# Altium project HoverBall_main.PrjPcb
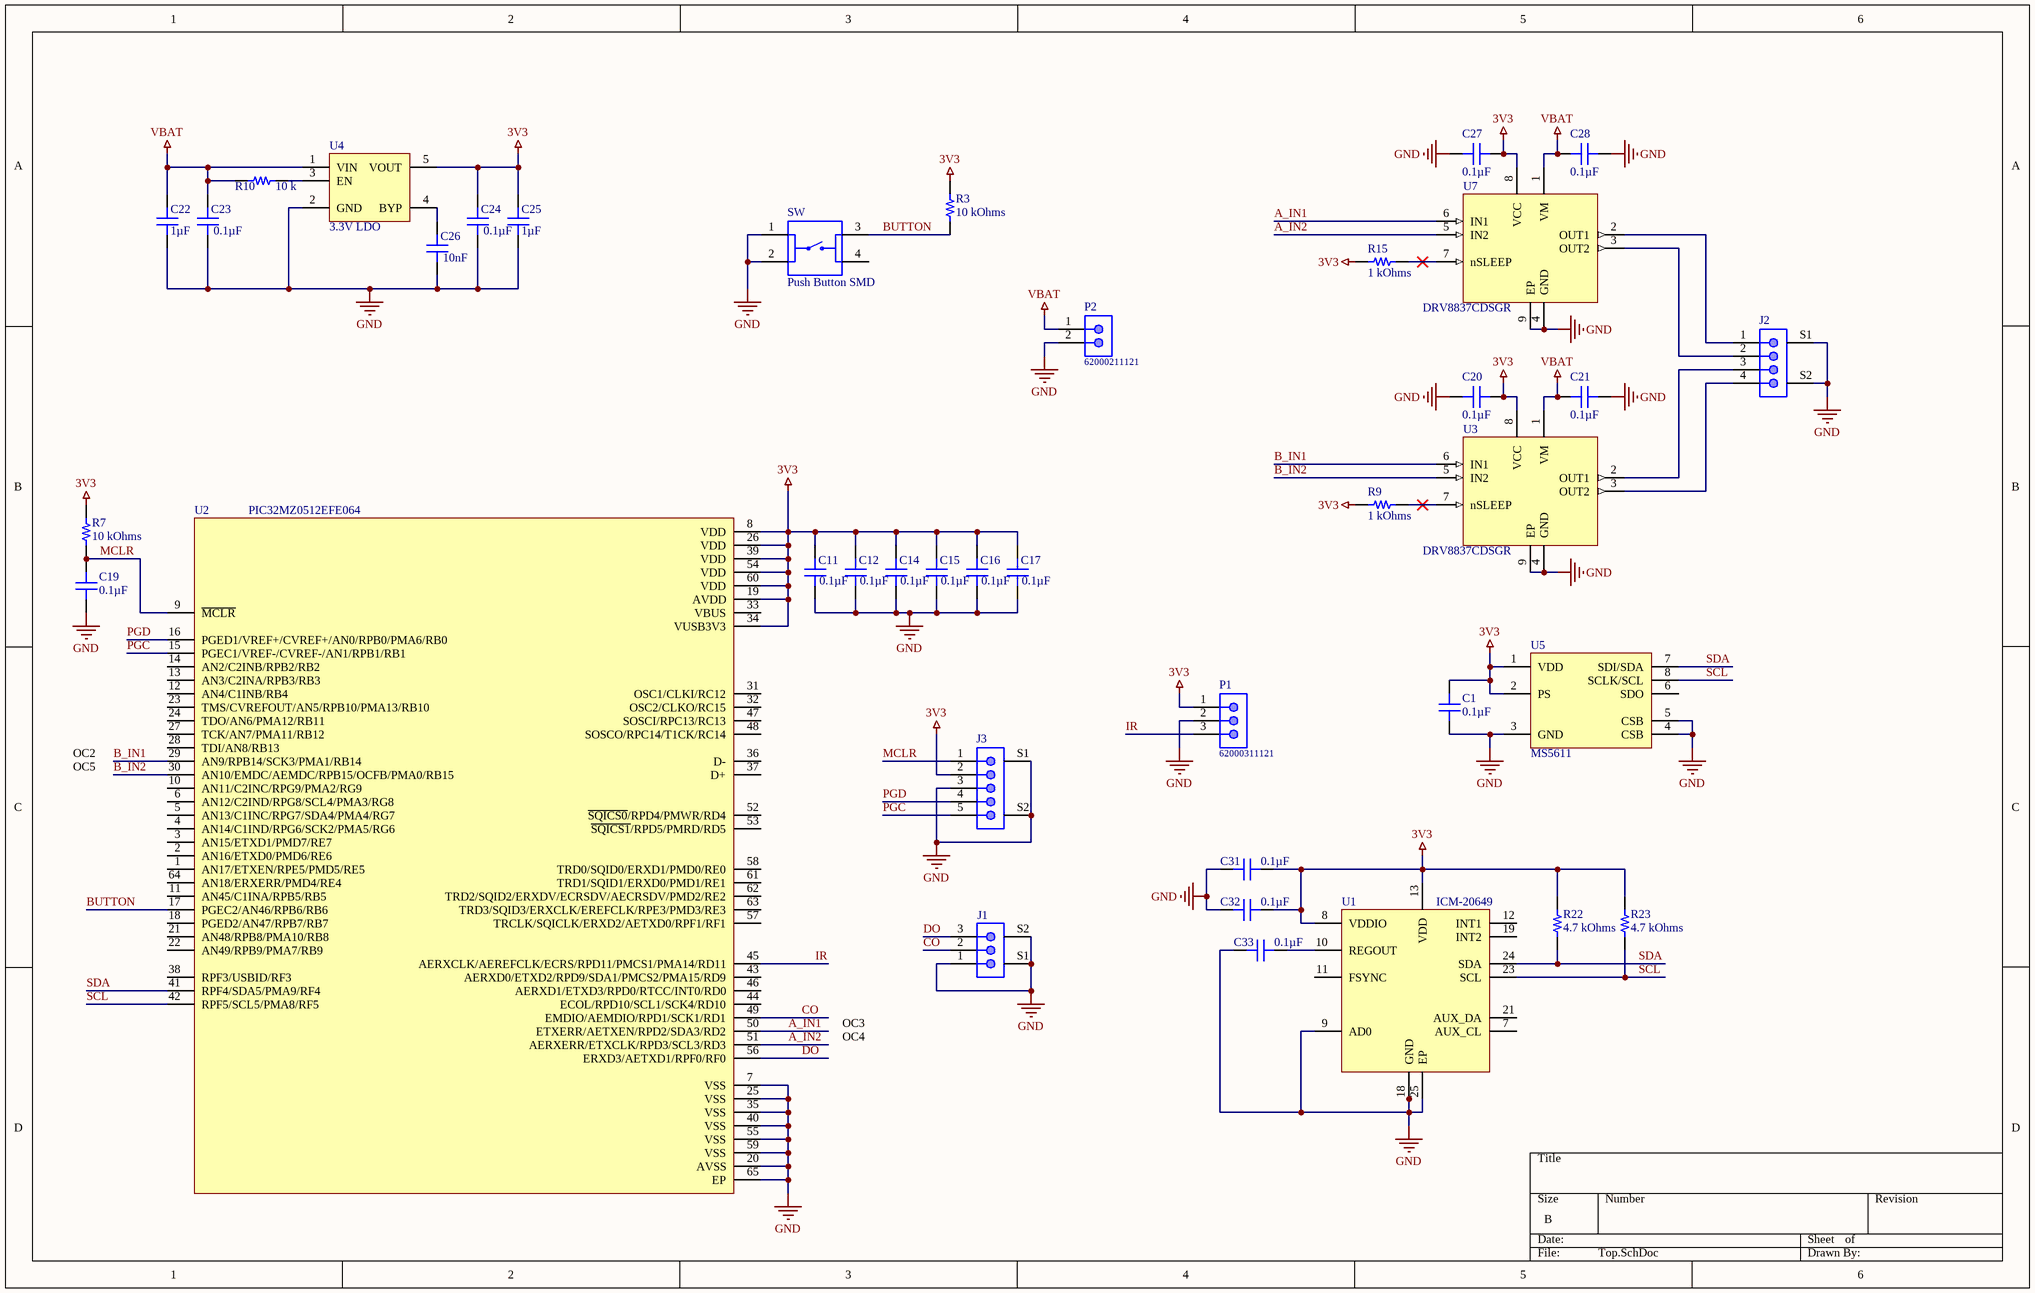
[diagram p0: Top.SchDoc]
1 sheet, 39 parts. Net scope: global (net labels, ports and power ports of the same name join across sheets).
Board file: HoverBall.PcbDoc

## Sheet Top.SchDoc
size B

### Parts
C1  0.1µF  [CAP 0603_1608]
C11  0.1µF  [CAP 0603_1608]
C12  0.1µF  [CAP 0603_1608]
C14  0.1µF  [CAP 0603_1608]
C15  0.1µF  [CAP 0603_1608]
C16  0.1µF  [CAP 0603_1608]
C17  0.1µF  [CAP 0603_1608]
C19  0.1µF  [CAP 0603_1608]
C20  0.1µF  [CAP 0603_1608]
C21  0.1µF  [CAP 0603_1608]
C22  1µF  [CAP 0603_1608]
C23  0.1µF  [CAP 0603_1608]
C24  0.1µF  [CAP 0603_1608]
C25  1µF  [CAP 0603_1608]
C26  10nF  [CAP 0603_1608]
C27  0.1µF  [CAP 0603_1608]
C28  0.1µF  [CAP 0603_1608]
C31  0.1µF  [CAP 0603_1608]
C32  0.1µF  [CAP 0603_1608]
C33  0.1µF  [CAP 0603_1608]
J1  3 pos 0.8mm  [BM03B-SURS]  (value not drawn)
J2  4 pos 0.8mm  [BM04B-SURS]  (value not drawn)
J3  5 pos 0.8mm  [BM05B-SURS]  (value not drawn)
P1  62000311121  [62000311121]
P2  62000211121  [62000211121]
R3  10 kOhms  [RES 0603_1608]
R7  10 kOhms  [RES 0603_1608]
R9  1 kOhms  [RES 0603_1608]
R10  10 k  [RES 0603_1608]
R15  1 kOhms  [RES 0603_1608]
R22  4.7 kOhms  [RES 0603_1608]
R23  4.7 kOhms  [RES 0603_1608]
SW  Push Button SMD  [SMD button]
U1  ICM-20649  [ICM-20649]
U2  PIC32MZ0512EFE064  [QFN50P900X900X100-65N]
U3  DRV8837CDSGR  [SON50P200X200X80-9N]
U4  3.3V LDO  [TI SOT-23-5 DBV]
U5  MS5611  [MS5611]
U7  DRV8837CDSGR  [SON50P200X200X80-9N]

### Nets
3V3: C1.2 C11.1 C12.1 C14.1 C15.1 C16.1 C17.1 C20.2 C24.1 C25.2 C27.2 C31.2 C32.2 J3.2 P1.1 R3.1 R7.2 R9.2 R15.2 R22.2 R23.2 U1.8(VDDIO) U1.13(VDD) U2.8(VDD) U2.19(AVDD) U2.26(VDD) U2.34(VUSB3V3) U2.39(VDD) U2.54(VDD) U2.60(VDD) U3.8(VCC) U4.5(VOUT) U5.1(VDD) U5.2(PS) U7.8(VCC)
GND: C1.1 C11.2 C12.2 C14.2 C15.2 C16.2 C17.2 C19.2 C20.1 C21.2 C22.1 C23.2 C24.2 C25.1 C26.2 C27.1 C28.2 C31.1 C32.1 C33.2 J1.1 J1.S1 J1.S2 J2.S1 J2.S2 J3.3 J3.S1 J3.S2 P1.2 P2.2 SW.1 SW.2 U1.9(AD0) U1.18(GND) U1.20(RESV) U1.25(EP) U2.7(VSS) U2.20(AVSS) U2.25(VSS) U2.35(VSS) U2.40(VSS) U2.55(VSS) U2.59(VSS) U2.65(EP) U3.4(GND) U3.9(EP) U4.2(GND) U5.3(GND) U5.4(CSB) U5.5(CSB) U7.4(GND) U7.9(EP)
VBAT: C21.1 C22.2 C23.1 C28.1 P2.1 R10.2 U3.1(VM) U4.1(VIN) U7.1(VM)
A_IN1: U2.50(ETXERR/AETXEN/RPD2/SDA3/RD2) U7.6(IN1)
A_IN2: U2.51(AERXERR/ETXCLK/RPD3/SCL3/RD3) U7.5(IN2)
B_IN1: U2.29(AN9/RPB14/SCK3/PMA1/RB14) U3.6(IN1)
B_IN2: U2.30(AN10/EMDC/AEMDC/RPB15/OCFB/PMA0/RB15) U3.5(IN2)
BUTTON: R3.2 SW.3 U2.17(PGEC2/AN46/RPB6/RB6)
CO: J1.2 U2.49(EMDIO/AEMDIO/RPD1/SCK1/RD1)
DO: J1.3 U2.56(ERXD3/AETXD1/RPF0/RF0)
IR: P1.3 U2.45(AERXCLK/AEREFCLK/ECRS/RPD11/PMCS1/PMA14/RD11)
MCLR: C19.1 J3.1 R7.1 U2.9(~{MCLR})
PGC: J3.5 U2.15(PGEC1/VREF-/CVREF-/AN1/RPB1/RB1)
PGD: J3.4 U2.16(PGED1/VREF+/CVREF+/AN0/RPB0/PMA6/RB0)
SCL: R23.1 U1.23(SCL) U2.42(RPF5/SCL5/PMA8/RF5) U5.8(SCLK/SCL)
SDA: R22.1 U1.24(SDA) U2.41(RPF4/SDA5/PMA9/RF4) U5.7(SDI/SDA)
NetC26_1: C26.1 U4.4(BYP)
NetC33_1: C33.1 U1.10(REGOUT)
NetJ2_1: J2.1 U7.2(OUT1)
NetJ2_2: J2.2 U7.3(OUT2)
NetJ2_3: J2.3 U3.2(OUT1)
NetJ2_4: J2.4 U3.3(OUT2)
NetR9_1: R9.1 U3.7(nSLEEP)
NetR10_1: R10.1 U4.3(EN)
NetR15_1: R15.1 U7.7(nSLEEP)

Not connected (* = marked no-connect by the designer): SW 4; U1 7(AUX_CL) 11(FSYNC) 12(INT1) 19(INT2) 21(AUX_DA); U2 1(AN17/ETXEN/RPE5/PMD5/RE5) 2(AN16/ETXD0/PMD6/RE6) 3(AN15/ETXD1/PMD7/RE7) 4(AN14/C1IND/RPG6/SCK2/PMA5/RG6) 5(AN13/C1INC/RPG7/SDA4/PMA4/RG7) 6(AN12/C2IND/RPG8/SCL4/PMA3/RG8) 10(AN11/C2INC/RPG9/PMA2/RG9) 11(AN45/C1INA/RPB5/RB5) 12(AN4/C1INB/RB4) 13(AN3/C2INA/RPB3/RB3) 14(AN2/C2INB/RPB2/RB2) 18(PGED2/AN47/RPB7/RB7) 21(AN48/RPB8/PMA10/RB8) 22(AN49/RPB9/PMA7/RB9) 23(TMS/CVREFOUT/AN5/RPB10/PMA13/RB10) 24(TDO/AN6/PMA12/RB11) 27(TCK/AN7/PMA11/RB12) 28(TDI/AN8/RB13) 31(OSC1/CLKI/RC12) 32(OSC2/CLKO/RC15) 33(VBUS) 36(D-) 37(D+) 38(RPF3/USBID/RF3) 43(AERXD0/ETXD2/RPD9/SDA1/PMCS2/PMA15/RD9) 44(ECOL/RPD10/SCL1/SCK4/RD10) 46(AERXD1/ETXD3/RPD0/RTCC/INT0/RD0) 47(SOSCI/RPC13/RC13) 48(SOSCO/RPC14/T1CK/RC14) 52(~{SQICS0}/RPD4/PMWR/RD4) 53(~{SQICS1}/RPD5/PMRD/RD5) 57(TRCLK/SQICLK/ERXD2/AETXD0/RPF1/RF1) 58(TRD0/SQID0/ERXD1/PMD0/RE0) 61(TRD1/SQID1/ERXD0/PMD1/RE1) 62(TRD2/SQID2/ERXDV/ECRSDV/AECRSDV/PMD2/RE2) 63(TRD3/SQID3/ERXCLK/EREFCLK/RPE3/PMD3/RE3) 64(AN18/ERXERR/PMD4/RE4); U5 6(SDO)

### Notes on the sheet
- OC2
- OC5
- OC3
- OC4

### Library data of the parts
C1 C11 C12 C14-C17 C19-C21 C23 C24 C27 C28 C31 C33 = GCG188R92A104KA03D: CAP CER 0.1UF 100V 0603 EPOXY; Manufacturer: Murata Electronics; Temperature Coefficient: X8R; Tolerance: ±10%; Part Number: GCG188R92A104KA03D; Value: 0.1µF; Applications: Automotive; Capacitance: 0.1µF; ComponentLink1Description: Datasheet; ComponentLink1URL: https://search.murata.co.jp/Ceramy/image/img/A01X/G101/ENG/GCG188R92A104KA03-01.pdf; ComponentLink2Description: DigiKey Link; ComponentLink2URL: http://digikey.com/product-detail/en/murata-electronics/GCG188R92A104KA03D/490-18197-1-ND/9867926; Device Package: 0603 (1608 Metric); Features: Epoxy Mountable; LastUpdated: 21-Jan-20 12:01:59 AM; Lifecycle Status: Active; Minimum Order: 1; Mounting Type: Surface Mount, MLCC, Epoxy; Operating Temperature: -55°C ~ 150°C; Package / Case: 0603 (1608 Metric); Packaging: TapeAndReel; PartId: 9025; Part Status: Active; Price: 0.07; Ratings: AEC-Q200; Series: GCG; Size / Dimension: 0.063" L x 0.031" W (1.60mm x 0.80mm); Supplier 1: DigiKey; Supplier Part Number 1: 490-18197-1-ND; Thickness (Max): 0.035" (0.90mm); Voltage - Rated: 100V
C22 C25 = GCJ188R71E105KA01D: CAP CER 1UF 25V X7R 0603; Manufacturer: Murata Electronics; Tolerance: ±10%; Part Number: GCJ188R71E105KA01D; Value: 1µF; Applications: Automotive, Boardflex Sensitive; Capacitance: 1µF; ComponentLink1Description: Datasheet; ComponentLink1URL: https://search.murata.co.jp/Ceramy/image/img/A01X/G101/ENG/GCJ188R71E105KA01-01.pdf; ComponentLink2Description: DigiKey Link; ComponentLink2URL: http://digikey.com/product-detail/en/murata-electronics/GCJ188R71E105KA01D/490-14409-1-ND/6606870; Device Package: 0603 (1608 Metric); Features: Soft Termination; LastUpdated: 13-Aug-20 10:24:06 AM; Lifecycle Status: Active; Minimum Order: 1; Mounting Type: Surface Mount, MLCC; Operating Temperature: -55°C ~ 125°C; Package / Case: 0603 (1608 Metric); Packaging: TapeAndReel; PartId: 9566; Part Status: Active; Price: 0.05; Ratings: AEC-Q200; Series: GCJ; Size / Dimension: 0.063" L x 0.031" W (1.60mm x 0.80mm); Supplier 1: DigiKey; Supplier Part Number 1: 490-14409-1-ND; Temperature Coefficient: X7R; Thickness (Max): 0.035" (0.90mm)
C26 = GCG188R92A104KA03D: CAP CER 0.1UF 100V 0603 EPOXY; Manufacturer: Murata Electronics; Capacitance: 0.1µF; Temperature Coefficient: X8R; Tolerance: ±10%; Part Number: GCG188R92A104KA03D; Value: 10nF; Applications: Automotive; ComponentLink1Description: Datasheet; ComponentLink1URL: https://search.murata.co.jp/Ceramy/image/img/A01X/G101/ENG/GCG188R92A104KA03-01.pdf; ComponentLink2Description: DigiKey Link; ComponentLink2URL: http://digikey.com/product-detail/en/murata-electronics/GCG188R92A104KA03D/490-18197-1-ND/9867926; Device Package: 0603 (1608 Metric); Features: Epoxy Mountable; LastUpdated: 21-Jan-20 12:01:59 AM; Lifecycle Status: Active; Minimum Order: 1; Mounting Type: Surface Mount, MLCC, Epoxy; Operating Temperature: -55°C ~ 150°C; Package / Case: 0603 (1608 Metric); Packaging: TapeAndReel; PartId: 9025; Part Status: Active; Price: 0.07; Ratings: AEC-Q200; Series: GCG; Size / Dimension: 0.063" L x 0.031" W (1.60mm x 0.80mm); Supplier 1: DigiKey; Supplier Part Number 1: 490-18197-1-ND; Thickness (Max): 0.035" (0.90mm); Voltage - Rated: 100V
C32 = C0603C103KARACAUTO: CAP CER 0.01UF 250V X7R 0603; Manufacturer: KEMET; Capacitance: 0.01µF; Tolerance: ±10%; Part Number: C0603C103KARACAUTO; Value: 0.1µF; Applications: Automotive, Bypass, Decoupling; ComponentLink1Description: Datasheet; ComponentLink1URL: https://api.kemet.com/component-edge/download/datasheet/C0603C103KARACAUTO.pdf; ComponentLink2Description: DigiKey Link; ComponentLink2URL: http://digikey.com/product-detail/en/kemet/C0603C103KARACAUTO/399-17960-1-ND/9084030; Device Package: 0603 (1608 Metric); LastUpdated: 13-Aug-20 10:21:06 AM; Lifecycle Status: Active; Minimum Order: 1; Mounting Type: Surface Mount, MLCC; Operating Temperature: -55°C ~ 125°C; Package / Case: 0603 (1608 Metric); Packaging: TapeAndReel; PartId: 15195; Part Status: Active; Price: 0.25; Ratings: AEC-Q200; Series: SMD Auto X7R; Size / Dimension: 0.063" L x 0.031" W (1.60mm x 0.80mm); Supplier 1: DigiKey; Supplier Part Number 1: 399-17960-1-ND; Temperature Coefficient: X7R; Thickness (Max): 0.034" (0.87mm)
J1 = BM03B-SURS
J2 = BM04B-SURS
J3 = BM05B-SURS
P1 = 62000311121: WR-PHD Pin Header, THT, pitch 2mm, Single Row, Vertical, 3p; Manufacturer: Wurth Elektronik; Pin Number: 3; Rated Current: 2A; Working Voltage: 200VAC; Withstanding Voltage: 500VAC; Contact Resistance: 20mOhm; ComponentLink1Description: Manufacturer; ComponentLink1URL: http://www.we-online.de; ComponentLink2Description: Datasheet; ComponentLink2URL: https://www.we-online.com/catalog/datasheet/62000311121.pdf; Operating Temperature: -40 to +105degC; Published Date: May 2020; Pitch: 2mm; Manufacturer Part Number: 62000311121; Mounting Technology: THT; Packaging: Bag; Gender: Pin Header; Row Number: Single; Orientation: Vertical
P2 = 62000211121: WR-PHD Pin Header, THT, pitch 2mm, Single Row, Vertical, 2p; Manufacturer: Wurth Elektronik; Pin Number: 2; Rated Current: 2A; Working Voltage: 200VAC; Withstanding Voltage: 500VAC; Contact Resistance: 20mOhm; ComponentLink1Description: Manufacturer; ComponentLink1URL: http://www.we-online.de; ComponentLink2Description: Datasheet; ComponentLink2URL: https://www.we-online.com/catalog/datasheet/62000211121.pdf; Operating Temperature: -40 to +105degC; Published Date: May 2020; Pitch: 2mm; Manufacturer Part Number: 62000211121; Mounting Technology: THT; Packaging: Bag; Gender: Pin Header; Row Number: Single; Orientation: Vertical
R3 = RT0603FRE071KL: RES SMD 1K OHM 1% 1/10W 0603; Manufacturer: Yageo; Power (Watts): 0.1W, 1/10W; Resistance: 1 kOhms; Temperature Coefficient: ±50ppm/°C; Part Number: RT0603FRE071KL; Value: 10 kOhms; ComponentLink1Description: Datasheet; ComponentLink1URL: https://www.yageo.com/upload/media/product/productsearch/datasheet/rchip/PYu-RT_1-to-0.01_RoHS_L_11.pdf; ComponentLink2Description: DigiKey Link; ComponentLink2URL: http://digikey.com/product-detail/en/yageo/RT0603FRE071KL/YAG2323CT-ND/5252437; Composition: Thin Film; Device Package: 0603 (1608 Metric); Height - Seated (Max): 0.022" (0.55mm); LastUpdated: 21-Jan-20 12:24:38 AM; Lifecycle Status: Active; Minimum Order: 1; Number of Terminations: 2; Operating Temperature: -55°C ~ 155°C; Package / Case: 0603 (1608 Metric); Packaging: TapeAndReel; PartId: 5672; Part Status: Active; Price: 0.01; Series: RT; Size / Dimension: 0.063" L x 0.031" W (1.60mm x 0.80mm); Supplier 1: DigiKey; Supplier Part Number 1: YAG2323CT-ND; Supplier Device Package: 0603; Tolerance: ±1%
R7 = RNCS0603BKE10K0: RES 10K OHM 0.1% 1/16W 0603; Manufacturer: Stackpole Electronics Inc; Power (Watts): 0.063W, 1/16W; Temperature Coefficient: ±25ppm/°C; Part Number: RNCS0603BKE10K0; Value: 10 kOhms; ComponentLink1Description: Datasheet; ComponentLink1URL: https://www.seielect.com/catalog/sei-rncs_rnch.pdf; ComponentLink2Description: DigiKey Link; ComponentLink2URL: http://digikey.com/product-detail/en/stackpole-electronics-inc/RNCS0603BKE10K0/RNCS0603BKE10K0CT-ND/1800113; Composition: Thin Film; Device Package: 0603 (1608 Metric); Features: Anti-Corrosive, Automotive AEC-Q200, Moisture Resistant; Height - Seated (Max): 0.022" (0.55mm); LastUpdated: 13-Aug-20 10:37:13 AM; Lifecycle Status: Active; Minimum Order: 1; Number of Terminations: 2; Operating Temperature: -55°C ~ 155°C; Package / Case: 0603 (1608 Metric); Packaging: TapeAndReel; PartId: 4838; Part Status: Active; Price: 0.08; Ratings: AEC-Q200; Resistance: 10 kOhms; Series: RNCS; Size / Dimension: 0.061" L x 0.031" W (1.55mm x 0.80mm); Supplier 1: DigiKey; Supplier Part Number 1: RNCS0603BKE10K0CT-ND; Supplier Device Package: 0603; Tolerance: ±0.1%
R9 R15 = RT0603FRE071KL: RES SMD 1K OHM 1% 1/10W 0603; Manufacturer: Yageo; Power (Watts): 0.1W, 1/10W; Temperature Coefficient: ±50ppm/°C; Part Number: RT0603FRE071KL; Value: 1 kOhms; ComponentLink1Description: Datasheet; ComponentLink1URL: https://www.yageo.com/upload/media/product/productsearch/datasheet/rchip/PYu-RT_1-to-0.01_RoHS_L_11.pdf; ComponentLink2Description: DigiKey Link; ComponentLink2URL: http://digikey.com/product-detail/en/yageo/RT0603FRE071KL/YAG2323CT-ND/5252437; Composition: Thin Film; Device Package: 0603 (1608 Metric); Height - Seated (Max): 0.022" (0.55mm); LastUpdated: 21-Jan-20 12:24:38 AM; Lifecycle Status: Active; Minimum Order: 1; Number of Terminations: 2; Operating Temperature: -55°C ~ 155°C; Package / Case: 0603 (1608 Metric); Packaging: TapeAndReel; PartId: 5672; Part Status: Active; Price: 0.01; Resistance: 1 kOhms; Series: RT; Size / Dimension: 0.063" L x 0.031" W (1.60mm x 0.80mm); Supplier 1: DigiKey; Supplier Part Number 1: YAG2323CT-ND; Supplier Device Package: 0603; Tolerance: ±1%
R10 = RNCS0603BKE10K0: RES 10K OHM 0.1% 1/16W 0603; Manufacturer: Stackpole Electronics Inc; Power (Watts): 0.063W, 1/16W; Resistance: 10 kOhms; Temperature Coefficient: ±25ppm/°C; Part Number: RNCS0603BKE10K0; Value: 10 k; ComponentLink1Description: Datasheet; ComponentLink1URL: https://www.seielect.com/catalog/sei-rncs_rnch.pdf; ComponentLink2Description: DigiKey Link; ComponentLink2URL: http://digikey.com/product-detail/en/stackpole-electronics-inc/RNCS0603BKE10K0/RNCS0603BKE10K0CT-ND/1800113; Composition: Thin Film; Device Package: 0603 (1608 Metric); Features: Anti-Corrosive, Automotive AEC-Q200, Moisture Resistant; Height - Seated (Max): 0.022" (0.55mm); LastUpdated: 21-Jan-20 12:25:01 AM; Lifecycle Status: Active; Minimum Order: 1; Number of Terminations: 2; Operating Temperature: -55°C ~ 155°C; Package / Case: 0603 (1608 Metric); Packaging: TapeAndReel; PartId: 4838; Part Status: Active; Price: 0.08; Ratings: AEC-Q200; Series: RNCS; Size / Dimension: 0.061" L x 0.031" W (1.55mm x 0.80mm); Supplier 1: DigiKey; Supplier Part Number 1: RNCS0603BKE10K0CT-ND; Supplier Device Package: 0603; Tolerance: ±0.1%
R22 R23 = CPF-A-0603B4K7E: RES SMD 4.7K OHM 0.1% 1/16W 0603; Manufacturer: TE Connectivity Passive Product; Power (Watts): 0.063W, 1/16W; Temperature Coefficient: ±25ppm/°C; Part Number: CPF-A-0603B4K7E; Value: 4.7 kOhms; ComponentLink1Description: Datasheet; ComponentLink1URL: https://www.te.com/commerce/DocumentDelivery/DDEController?Action=srchrtrv&DocNm=1773200-1&DocType=DS&DocLang=English; ComponentLink2Description: DigiKey Link; ComponentLink2URL: http://digikey.com/product-detail/en/te-connectivity-passive-product/CPF-A-0603B4K7E/A124067CT-ND/5969987; Composition: Thin Film; Device Package: 0603 (1608 Metric); Features: Anti-Sulfur, Automotive AEC-Q200, Moisture Resistant; Height - Seated (Max): 0.022" (0.55mm); LastUpdated: 13-Aug-20 10:37:07 AM; Lifecycle Status: Active; Minimum Order: 1; Number of Terminations: 2; Operating Temperature: -55°C ~ 155°C; Package / Case: 0603 (1608 Metric); Packaging: TapeAndReel; PartId: 8242; Part Status: Active; Price: 0.09; Ratings: AEC-Q200; Resistance: 4.7 kOhms; Series: CPF-A, Neohm; Size / Dimension: 0.061" L x 0.031" W (1.55mm x 0.80mm); Supplier 1: DigiKey; Supplier Part Number 1: A124067CT-ND; Supplier Device Package: 0603; Tolerance: ±0.1%
SW = Push Button SMD: 50 mA SPST Round Actuator 160 Gram Force Tactile Pushbutton Switch; MP: 1825910-2; Contact_Current_Rating: 50 mA; MF: TE Connectivity; Configuration_Pole-Throw: Single Pole - Single Throw; Availability: Unavailable; Value: *; Package: None; SnapEDA_Link: https://www.snapeda.com/parts/1825910-2/TE%20Connectivity%20ALCOSWITCH%20Switches/view-part/278983/?ref=snap; TE_purchase_URL: https://www.te.com/usa-en/product-1825910-2.html?te_bu=Cor&te_type=disp&te_campaign=seda_glo_cor-seda-global-disp-prtnr-fy19-seda-model-bom-cta_sma-317_1&elqCampaignId=32493; EU_RoHS_Compliance: Compliant; Price: None
U1 = ICM-20649: 6-DOF IMU
U2 = PIC32MZ0512EFE064-I/PT: 32-bit Microcontrollers - MCU 32-BIT MCU 512KB FL 128KB RAM, No Crypto; MF: Microchip; MP: PIC32MZ2048EFG064T-I/PT; Price: None; Value: *; SnapEDA_Link: https://www.snapeda.com/parts/PIC32MZ2048EFG064T-I/PT/Microchip/view-part/565997/?ref=snap; Package: TQFP-64 Microchip; Availability: Unavailable
U3 U7 = DRV8837CDSGR: 11-V, 1-A H-bridge motor driver 8-WSON -40 to 85; MF: Texas Instruments; Mouser-Purchase-URL: https://snapeda.com/shop?store=Mouser&id=617854; Value: *; DigiKey-Purchase-URL: https://snapeda.com/shop?store=DigiKey&id=617854; Package: WSON-8 Texas Instruments; Texas_Instruments-Purchase-URL: https://snapeda.com/shop?store=Texas+Instruments&id=617854; Price: None; MP: DRV8837CDSGR; SnapEDA_Link: https://www.snapeda.com/parts/DRV8837CDSGR/Texas%20Instruments/view-part/617854/?ref=snap; Availability: Good
U4 = MIC5504-3.3YM5
U5 = MS5611: Altimeter

## Assembly variants
Main: not fitted J5 M1 M2 P1 P2 P3 P6 P6 P7 P7 P8 P8 P9 P9 R8 R14